# EAGLE design windvane_v2 (EAGLE 9.5.2)
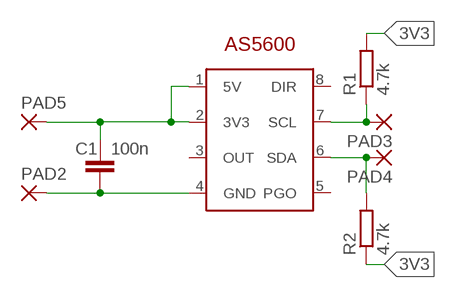
[diagram p0: schematic, sheet 1]

## Parts
C1  100n  C-EUC1206  [C1206]
PAD2  1,6/0,8  [1,6/0,8]
PAD3  1,6/0,8  [1,6/0,8]
PAD4  1,6/0,8  [1,6/0,8]
PAD5  1,6/0,8  [1,6/0,8]
R1  4.7k  R-EU_R1206  [R1206]
R2  4.7k  R-EU_R1206  [R1206]
U$1  AS5600  [SOIC127P600X175-8N]

## Nets
3V3: C1.1 PAD5.1(P) R1.2 R2.1 U$1.1(5V) U$1.2(3V3)
GND: C1.2 PAD2.1(P) U$1.4(GND)
SCL: PAD3.1(P) R1.1 U$1.7(SCL)
SDA: PAD4.1(P) R2.2 U$1.6(SDA)
Unconnected: U$1.3(OUT) U$1.5(PGO) U$1.8(DIR)

## Library data of the parts
C1 = rcl:C-EU: CAPACITOR, European symbol; SPICEPREFIX: C
PAD2-PAD5 = wirepad:1,6/0,8: THROUGH-HOLE PAD
R1 R2 = rcl:R-EU_: RESISTOR, European symbol; SPICEPREFIX: R
U$1 = SOIC127P600X175-8N:AS5600

## Board
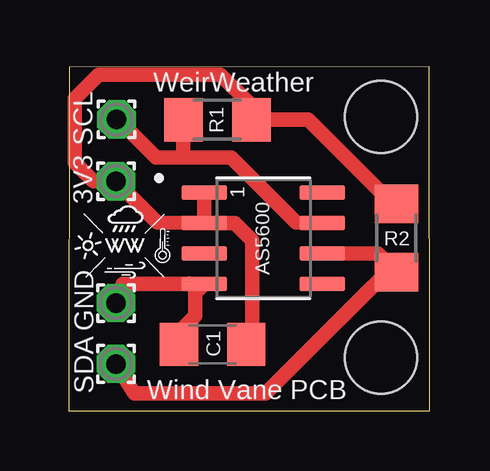
[diagram p1: board, top side]

Size 15.04 x 14.34 mm. Coordinates in mm from the lower left corner, seen from the top.
Outline: 0,0 15.04,0.01 15.02,14.34 0.01,14.33 0,0
Copper layers (1*16): Top 0.035mm / dielectric 1.5mm / Bottom 0.035mm
Design rules "default *": minimum track width 6mil, minimum drill 0.35mm, track to track 11mil, track to pad 11mil, pad to pad 11mil, via to via 11mil, smd to smd 6mil, copper to edge 0mil, drill to drill 6mil, minimum pad ring 10mil, minimum via ring 8mil, stop-mask expansion 4mil, vias tented up to drill 0mil, thermal gap 10mil
Holes 3 mm at 13,12.25 13,2.22

### Footprints (pad centres in the part's own frame; a part is rotated, then mirrored left to right if it is on the bottom)
C1206 = smd 1.6 x 1.8: 1 -1.4,0; 2 1.4,0
1,6/0,8 = drill 0.813 pad 1.6 octagon: 1 0,0
R1206 = smd 1.6 x 1.803: 1 -1.422,0; 2 1.422,0
SOIC127P600X175-8N = smd 1.9 x 0.6: 1 -2.455,1.905; 2 -2.455,0.635; 3 -2.455,-0.635; 4 -2.455,-1.905; 5 2.455,-1.905; 6 2.455,-0.635; 7 2.455,0.635; 8 2.455,1.905

### Placement (x,y rotation side)
C1  5.99,2.77 180 top
PAD2  1.96,4.5 0 top
PAD3  1.98,12.15 0 top
PAD4  1.96,1.96 0 top
PAD5  1.96,9.58 90 top
R1  6.19,12.14 0 top
R2  13.65,7.21 270 top
U$1  8.1,7.2 0 top

### Tracks (layer width: path | path; a pad name or v marks a point on that pad's centre or on a via)
3V3
  Top 0.61: C1.1 7.64,3.02 7.64,7.1 6.9,7.84 U$1.2 | R2.1 13.48,8.63 9.97,12.14 R1.2 7.61,12.72 6.31,14.02 1.24,14.02 0.24,13.02 0.24,10.34 1,9.57 PAD5.1 3.69,7.84 U$1.2 | U$1.1 U$1.2
GND  (1 unrouted)
  Top 0.61: PAD2.1 2.23,5.29 4.97,5.29 | 5,5.3 U$1.4 5.26,4.92 5.26,3.96 4.59,3.29 C1.2
SCL
  Top 0.61: U$1.7 9.46,7.84 6.75,10.55 4.76,10.55 | 4.76,10.55 3.64,10.55 2.05,12.15 PAD3.1 | R1.1 4.76,10.55
SDA
  Top 0.61: PAD4.1 2.73,0.73 8.21,0.73 13.26,5.78 R2.2 12.87,6.56 10.56,6.56 U$1.6

### Text on the board
tNames: WeirWeather | SCL | 3V3 | 1 | AS5600 | GND | SDA | Wind Vane PCB